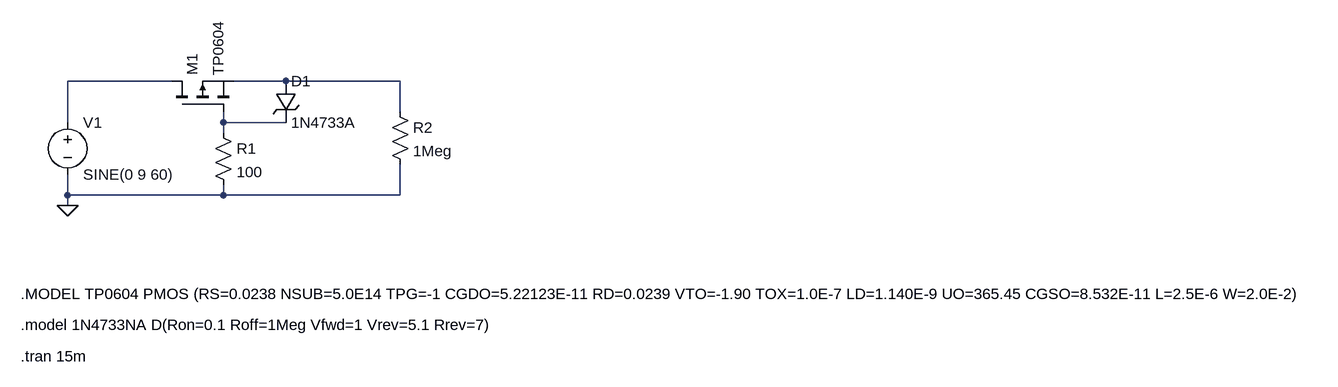
[diagram p0: schematic Project_1.asc]
Project_1.asc, the LTspice schematic file:
Version 4.1
SHEET 1 2044 680
WIRE 176 -64 16 -64
WIRE 352 -64 272 -64
WIRE 528 -64 352 -64
WIRE 528 -16 528 -64
WIRE 16 0 16 -64
WIRE 256 0 256 -16
WIRE 352 0 256 0
WIRE 256 16 256 0
WIRE 16 112 16 80
WIRE 256 112 256 96
WIRE 256 112 16 112
WIRE 528 112 528 64
WIRE 528 112 256 112
WIRE 16 128 16 112
FLAG 16 128 0
SYMBOL pmos 176 -16 R270
SYMATTR InstName M1
SYMATTR Value TP0604
SYMBOL voltage 16 -16 R0
WINDOW 123 0 0 Left 0
WINDOW 39 0 0 Left 0
SYMATTR InstName V1
SYMATTR Value SINE(0 9 60)
SYMBOL res 240 0 R0
SYMATTR InstName R1
SYMATTR Value 100
SYMBOL zener 336 -64 R0
SYMATTR InstName D1
SYMATTR Value 1N4733A
SYMBOL res 512 -32 R0
SYMATTR InstName R2
SYMATTR Value 1Meg
TEXT -56 360 Left 2 !.tran 15m
TEXT -56 264 Left 2 !.MODEL TP0604 PMOS (RS=0.0238 NSUB=5.0E14 TPG=-1 CGDO=5.22123E-11 RD=0.0239 VTO=-1.90 TOX=1.0E-7 LD=1.140E-9 UO=365.45 CGSO=8.532E-11 L=2.5E-6 W=2.0E-2)
TEXT -56 312 Left 2 !.model 1N4733NA D(Ron=0.1 Roff=1Meg Vfwd=1 Vrev=5.1 Rrev=7)

The netlist it stands for:
* Project_1.asc
M1 N001 N003 N002 N002 TP0604
V1 N001 0 SINE(0 9 60)
R1 N003 0 100
D1 N002 N003 1N4733A
R2 N002 0 1Meg
.model D D
.lib standard.dio
.model NMOS NMOS
.model PMOS PMOS
.lib standard.mos
.tran 15m
.MODEL TP0604 PMOS (RS=0.0238 NSUB=5.0E14 TPG=-1 CGDO=5.22123E-11 RD=0.0239 VTO=-1.90 TOX=1.0E-7 LD=1.140E-9 UO=365.45 CGSO=8.532E-11 L=2.5E-6 W=2.0E-2)
.model 1N4733NA D(Ron=0.1 Roff=1Meg Vfwd=1 Vrev=5.1 Rrev=7)
.backanno
.end